# EasyEDA Pro project EasyEdaProFile.epro

# Board PCB_PCB_Usbhub_2025-11-19
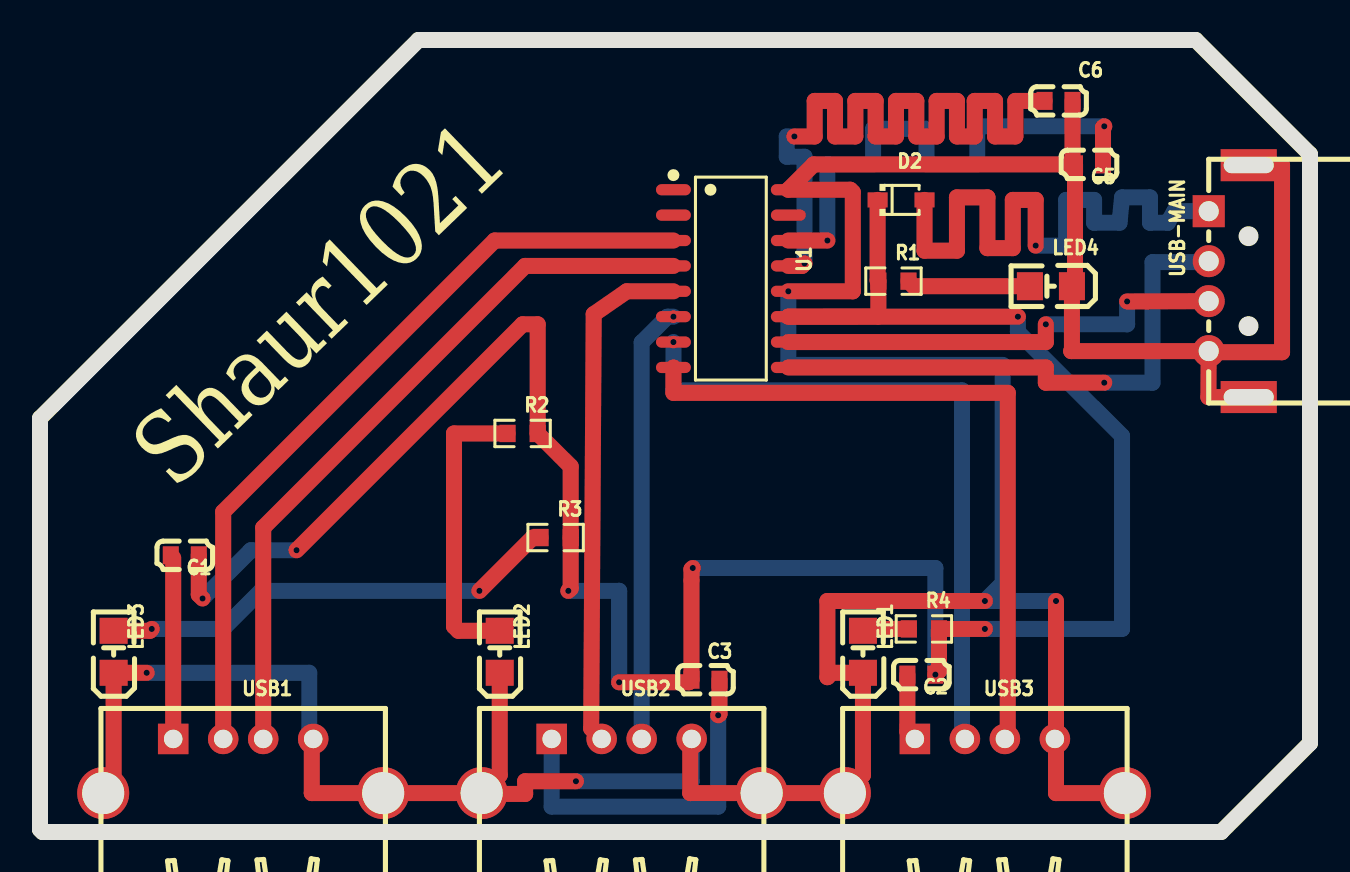
[diagram p0: board, top side]
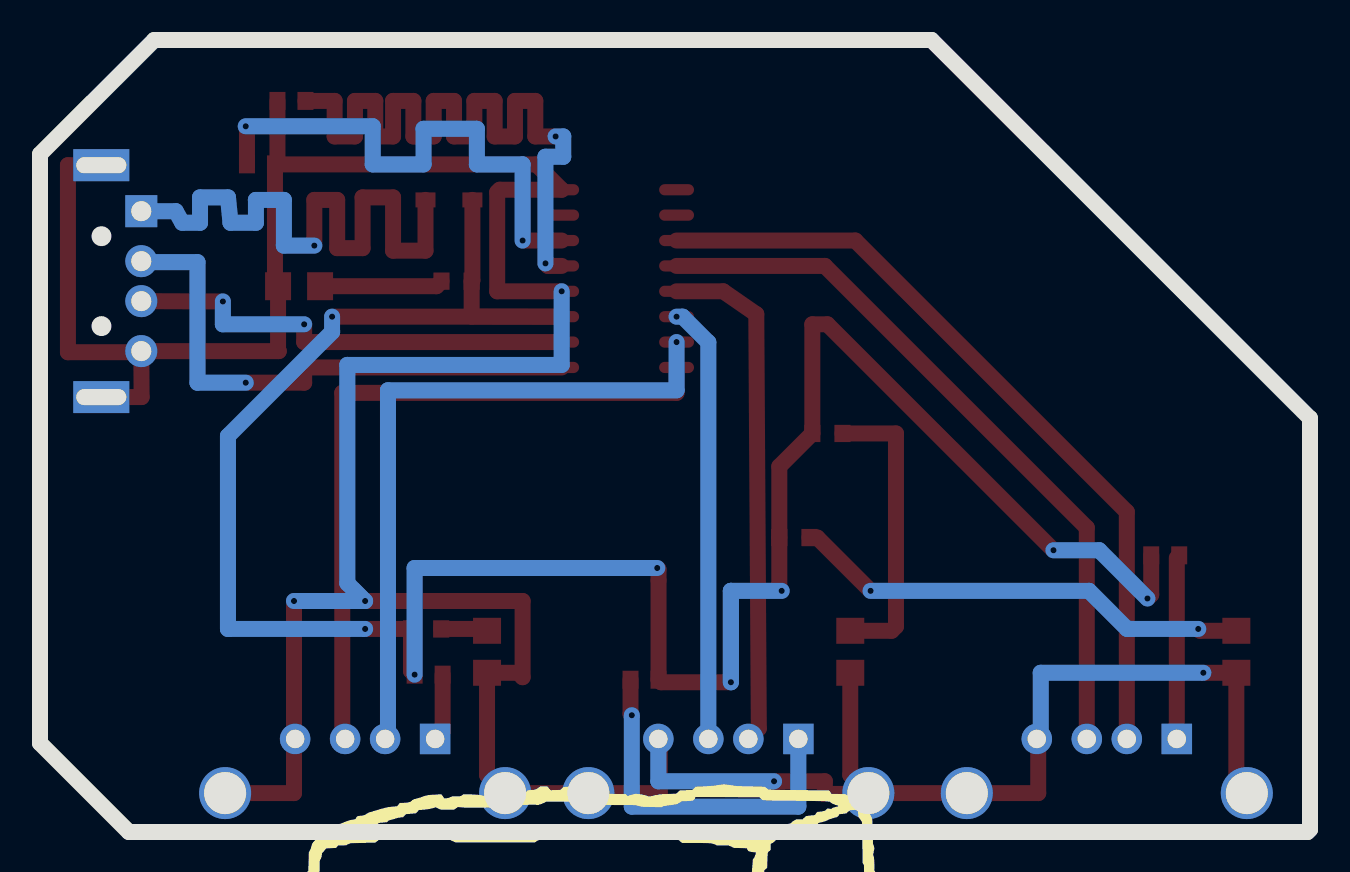
[diagram p1: board, bottom side, seen from below]

Outline 63.5 x 39.62 mm; copper layers: Top Layer, Bottom Layer. Coordinates in mm from the lower left corner of the outline.
Outline path: 0,20.7 0,0.13 0.13,0 59.06,0 63.5,4.44 63.5,33.91 57.78,39.62 18.92,39.62 0,20.7

## Design rules (mm)
via Default (default): diameter min 0.61, default 0.61, max 100.025; hole min 0.305, default 0.305, max 59.995

## Placement (name value [footprint] x y rotation side)
C1  10uF  [C0603]  7.24 13.84 180 top
C2  10uF  [C0603]  44.07 7.87 180 top
C3  10uF  [C0603]  33.27 7.62 0 top
C5  10uF  [C0603]  52.45 33.4 180 top
C6  10uF  [C0603]  50.93 36.58 0 top
D2  NSR0320MW2T1G  [SOD-323_L1.8-W1.3-LS2.5-RD]  43.05 31.62 0 top
LED1  YLED0805G  [LED0805-FD-GREEN]  41.15 9.02 270 top
LED2  YLED0805G  [LED0805-FD-GREEN]  22.99 9.02 270 top
LED3  YLED0805G  [LED0805-FD-GREEN]  3.68 9.02 270 top
LED4  YLED0805G  [LED0805-FD-GREEN]  50.55 27.3 0 top
R1  47Ω  [R0603]  42.67 27.56 0 top
R2  47Ω  [R0603]  24.13 19.94 0 top
R3  47Ω  [R0603]  25.78 14.73 0 top
R4  47Ω  [R0603]  44.2 10.16 0 top
U1  SL2.1A  [SOP-16_L10.0-W3.9-P1.27-LS6.0-BL]  34.54 27.69 270 top
USB1  USB-AF-90-14.4X13.6-H7.0-DIP  [USB-A-TH_C46407]  10.16 3.3 0 top
USB2  USB-AF-90-14.4X13.6-H7.0-DIP  [USB-A-TH_C46407]  29.08 3.3 0 top
USB3  USB-AF-90-14.4X13.6-H7.0-DIP  [USB-A-TH_C46407]  47.24 3.3 0 top
USB-MAIN  U-G-04DD-W-01  [USB-A-TH_U-G-04WD-W-01]  59.44 27.56 90 top

## Footprints (pads in the part's own frame, mm; a bottom-side part is the same pattern mirrored in y, then rotated)
C0603
  rect 0.8x0.9 smd: 1(-0.7,0) 2(0.7,0)
LED0805-FD-GREEN
  rect 1.3x1.4 smd: 1(-1.05,0)
  rect 1.3x1.399 smd: 2(1.05,0)
R0603
  rect 0.806x0.864 smd: 1(-0.753,0) 2(0.753,0)
SOD-323_L1.8-W1.3-LS2.5-RD
  rect 1x0.75 smd: 1(-1.173,0) 2(1.173,0)
SOP-16_L10.0-W3.9-P1.27-LS6.0-BL
  oval 0.56x1.745 smd: 1(-4.445,-2.873) 2(-3.175,-2.873) 3(-1.905,-2.873) 4(-0.635,-2.873) 5(0.635,-2.873) 6(1.905,-2.873) 7(3.175,-2.873) 8(4.445,-2.873) 9(4.445,2.873) 10(3.175,2.873) 11(1.905,2.873) 12(0.635,2.873) 13(-0.635,2.873) 14(-1.905,2.873) 15(-3.175,2.873) 16(-4.445,2.873)
USB-A-TH_C46407
  rect 1.524x1.524 hole 0.92: 1(-3.5,1.355)
  round 1.524 hole 0.92: 2(-1,1.355) 3(1,1.355) 4(3.5,1.355)
  round 2.6 hole 2.1: 5(7,-1.355) 6(-7,-1.355)
USB-A-TH_U-G-04WD-W-01
  rect 1.6x1.6 hole 1: 1(3.5,1)
  round 1.6 hole 1: 2(1,1) 3(-1,1) 4(-3.5,1)
  rect 1.6x2.8 hole 0.8x2.5: 5(5.8,-1) 6(-5.8,-1)

## Nets
+5V: C1.1 C2.1 C3.1 D2.1 R1.1 R2.2 R3.2 R4.2 U1.11
GND: C5.2 C6.2 LED1.2 LED2.2 LED3.2 LED4.2 U1.12 U1.16 USB1.4 USB1.5 USB1.6 USB2.4 USB2.5 USB2.6 USB3.4 USB3.5 USB3.6 USB-MAIN.4 USB-MAIN.5 USB-MAIN.6
R1_2: LED4.1 R1.2
R2_1: LED2.1 R2.1
R3_1: LED3.1 R3.1
R4_1: LED1.1 R4.1
U1_3: U1.3 USB1.2
U1_4: U1.4 USB1.3
U1_13: C6.1 U1.13
U1_14: C5.1 U1.14
USB1_1: C1.2 USB1.1
USB2_1: C3.2 USB2.1
USB2_2: U1.5 USB2.2
USB2_3: U1.6 USB2.3
USB3_1: C2.2 USB3.1
USB3_2: U1.7 USB3.2
USB3_3: U1.8 USB3.3
USB-MAIN_1: D2.2 USB-MAIN.1
USB-MAIN_2: U1.9 USB-MAIN.2
USB-MAIN_3: U1.10 USB-MAIN.3

Pads without a net: U1 1 2 15

## Via types
v1: diameter 0.62, hole 0.31, Top Layer to Bottom Layer, 26 vias

## Routing (per net, layer and track width the routed paths; a pad name or vN(x,y) marks a point on that pad's centre or on a via; arc(x,y) is an arc through that point)
+5V: length 128.3
  Top Layer w0.8: v1(32.64,13.21) 32.57,13.14 32.57,7.62 ; v1(26.42,12.06) 26.53,12.18 R3.2 26.53,18.29 R2.2 24.88,25.4 24.13,25.4 v1(12.83,14.1) ; v1(8.13,11.68) 7.94,11.87 C1.1 ; v1(48.9,25.78) U1.11 41.92,25.79 R1.1 41.88,27.6 D2.1 ; C3.1 32.45,7.49 v1(28.96,7.49) ; v1(47.24,10.16) R4.2 44.95,8.05 v1(44.77,7.87)
  Bottom Layer w0.8: v1(12.83,14.1) 10.54,14.1 v1(8.13,11.68) ; v1(47.24,10.16) 54.1,10.16 54.1,19.81 48.9,25.02 v1(48.9,25.78) ; v1(44.77,7.87) 44.77,13.21 v1(32.64,13.21) ; 28.96,12.06 v1(28.96,7.49) 28.96,12.06 ; 28.96,12.06 v1(26.42,12.06)
GND: length 188.8
  Top Layer w0.8: USB2.4 32.51,4.59 32.51,1.95 USB2.5 USB3.6 41.15,2.85 LED1.2 39.59,7.97 39.37,7.75 39.37,11.56 v1(47.24,11.56) ; v1(26.8,2.54) 24.26,2.54 24.26,1.91 22.12,1.91 USB2.6 ; v1(5.33,7.97) LED3.2 3.68,2.47 USB1.6 ; 51.63,36.58 51.63,33.52 C5.2 ; USB1.4 13.59,4.59 13.59,1.95 USB1.5 USB2.6 ; C5.2 38.69,33.4 U1.16 40.51,32.13 40.64,32 40.64,27.05 v1(37.42,27.05) ; C5.2 51.75,27.46 LED4.2 51.6,24.09 51.56,24.06 USB-MAIN.4 ; USB-MAIN.4 58.42,21.76 USB-MAIN.6 ; USB-MAIN.4 58.49,24 62.1,24 62.1,33.36 USB-MAIN.5 ; USB2.6 22.99,2.85 LED2.2 ; USB3.5 50.8,1.95 50.8,4.6 USB3.4 50.8,4.71 v1(50.8,11.56)
  Bottom Layer w0.8: v1(26.8,2.54) 32.58,2.54 USB2.4 ; v1(50.8,11.56) v1(47.24,11.56) 48.13,12.45 48.13,23.37 37.42,23.37 v1(37.42,27.05) ; USB1.4 13.46,4.85 13.46,7.97 v1(5.33,7.97)
R1_2: length 6.2
  Top Layer w0.8: LED4.1 43.68,27.3 R1.2
R2_1: length 14.7
  Top Layer w0.8: R2.1 20.7,19.94 20.7,10.29 20.92,10.07 LED2.1
R3_1: length 23.3
  Top Layer w0.8: v1(5.59,10.16) 5.5,10.07 LED3.1 ; v1(21.97,12.06) 24.64,14.73 R3.1
  Bottom Layer w0.8: v1(5.59,10.16) 9.14,10.16 11.05,12.06 v1(21.97,12.06)
R4_1: length 2.3
  Top Layer w0.8: LED1.1 41.24,10.16 R4.1
U1_3: length 39.5
  Top Layer w0.8: 9.16,4.66 9.16,16.02 22.73,29.59 U1.3
U1_4: length 36.5
  Top Layer w0.8: U1.4 24.26,28.32 11.16,15.22 11.16,4.66
U1_13: length 40.5
  Top Layer w0.8: C6.1 48.77,36.58 48.77,34.8 47.75,34.8 47.75,36.58 46.74,36.58 46.74,34.8 45.85,34.8 45.85,36.58 44.83,36.58 44.83,34.8 43.81,34.8 43.81,36.58 42.8,36.58 42.8,34.8 41.78,34.8 41.78,36.58 40.77,36.58 40.77,34.8 39.75,34.8 39.75,36.58 38.74,36.58 38.74,34.8 v1(37.72,34.8) ; v1(38.23,28.45) 38.1,28.32 U1.13
  Bottom Layer w0.8: v1(38.23,28.45) 38.23,33.78 37.34,33.78 37.34,34.8 v1(37.72,34.8)
U1_14: length 27
  Top Layer w0.8: v1(53.21,35.31) 53.15,35.24 53.15,33.4 ; U1.14 v1(39.37,29.59)
  Bottom Layer w0.8: v1(53.21,35.31) 46.86,35.31 46.86,33.4 44.32,33.4 44.32,35.18 41.66,35.18 41.66,33.4 39.37,33.4 v1(39.37,29.59)
USB1_1: length 9.1
  Top Layer w0.8: USB1.1 6.66,13.72
USB2_1: length 18.1
  Top Layer w0.8: C3.2 33.97,5.91 v1(33.91,5.84)
  Bottom Layer w0.8: v1(33.91,5.84) 33.91,1.27 25.58,1.27 25.58,4.66
USB2_2: length 25.8
  Top Layer w0.8: U1.5 29.34,27.05 27.69,25.91 27.56,5.18 28.08,4.66
USB2_3: length 22
  Bottom Layer w0.8: 30.08,4.66 30.08,24.5 31.37,25.78 v1(31.67,25.78)
USB3_1: length 3.4
  Top Layer w0.8: C2.2 43.37,5.03 USB3.1
USB3_2: length 34.3
  Bottom Layer w0.8: v1(31.67,24.51) 31.67,22.1 46.1,22.1 46.1,4.8 USB3.2
USB3_3: length 35.4
  Top Layer w0.8: USB3.3 48.39,4.8 48.39,21.97 31.67,21.97 U1.8
USB-MAIN_1: length 32.8
  Top Layer w0.8: D2.2 44.23,29.08 45.85,29.08 45.85,31.75 47.37,31.75 47.37,29.21 48.64,29.21 48.64,31.62 49.78,31.62 v1(49.78,29.34)
  Bottom Layer w0.8: USB-MAIN.1 56.71,31.06 56.39,30.48 55.5,30.48 55.5,31.75 54.1,31.75 53.97,30.48 52.71,30.48 52.71,31.62 51.31,31.62 51.31,29.34 v1(49.78,29.34)
USB-MAIN_2: length 27.8
  Top Layer w0.8: U1.9 50.29,23.24 50.29,22.48 v1(53.21,22.48)
  Bottom Layer w0.8: v1(53.21,22.48) 55.63,22.48 55.63,28.51 58.39,28.51 USB-MAIN.2
USB-MAIN_3: length 23.1
  Top Layer w0.8: U1.10 50.29,24.51 v1(50.29,25.4) ; v1(54.36,26.54) USB-MAIN.3
  Bottom Layer w0.8: v1(54.36,26.54) 54.36,25.4 v1(50.29,25.4)

## Text on the board
Top Silkscreen Layer: Shaur1021
